# Altium project PCB_Project1.PrjPCB
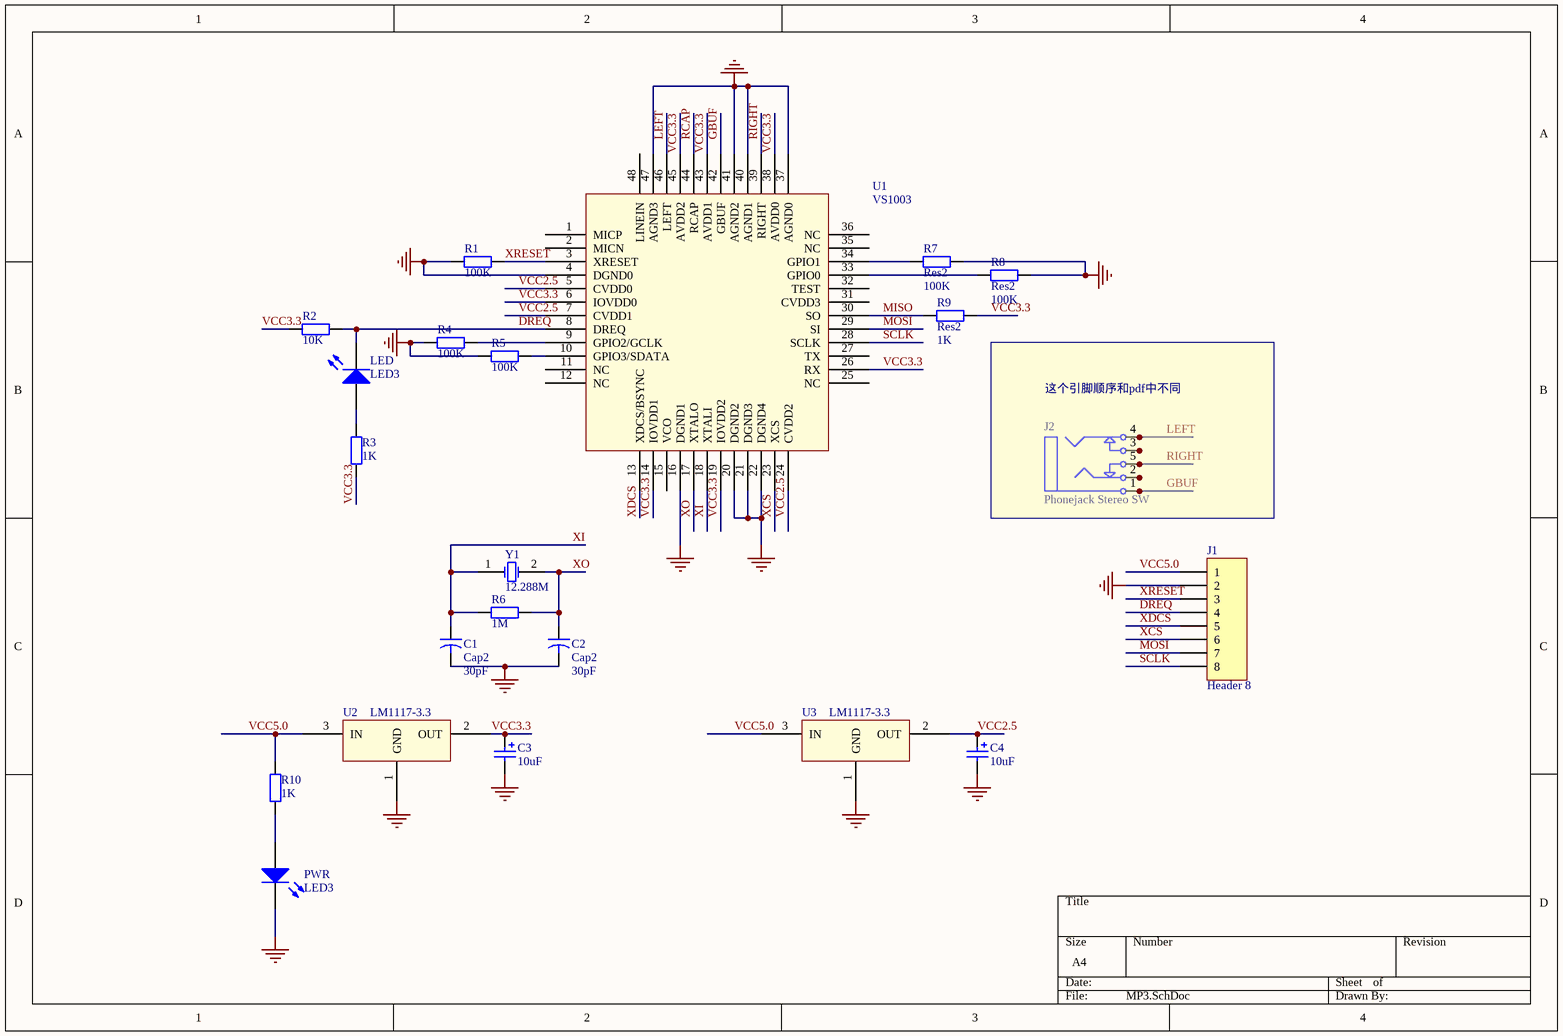
[diagram p0: MP3.SchDoc]
2 sheets, 38 parts. Net scope: global (net labels, ports and power ports of the same name join across sheets).
Sheets:
  MP3.SchDoc
  SD.SchDoc

## Sheet MP3.SchDoc
size A4

### Parts
(Parts that share a designator on the sheet are numbered #1, #2 ... from top to bottom, then left to right.)
C1  Cap2  value 30pF  [CAPR5-4X5]
C2  Cap2  value 30pF  [CAPR5-4X5]
C3#1  value 10uF  [CC2012-0805]  (hidden comment: Cap Pol3)
C4  value 10uF  [CC2012-0805]  (hidden comment: Cap Pol3)
J1  Header 8  [HDR1X8]
J2  Phonejack Stereo SW  [ST-3150-5N]
LED  LED3  [SMD _LED]
PWR#1  LED3  [SMD _LED]
R1#1  value 100K  [AXIAL-0.4]  (hidden comment: Res2)
R2#1  value 10K  [AXIAL-0.4]  (hidden comment: Res2)
R3#1  value 1K  [AXIAL-0.4]  (hidden comment: Res2)
R4#1  value 100K  [AXIAL-0.4]  (hidden comment: Res2)
R5#1  value 100K  [AXIAL-0.4]  (hidden comment: Res2)
R6#1  value 1M  [AXIAL-0.4]  (hidden comment: Res2)
R7  Res2  value 100K  [AXIAL-0.4]
R8  Res2  value 100K  [AXIAL-0.4]
R9  Res2  value 1K  [AXIAL-0.4]
R10#1  value 1K  [AXIAL-0.4]  (hidden comment: Res2)
U1#1  VS1003  [vs1003]
U2  LM1117-3.3  [SOT-223]
U3  LM1117-3.3  [SOT-223]
Y1  12.288M  [BCY-W2/D3.1]

### Blocks framed on the sheet
这个引脚顺序和pdf中不同: J2

### Nets
GND: C1.2 C2.2 C3#1.2 C4.2 J1.2 PWR#1.2(K) R1#1.1 R4#1.1 R5#1.1 R7.2 R8.2 U1#1.4(DGND0) U1#1.16(DGND1) U1#1.20(DGND2) U1#1.21(DGND3) U1#1.22(DGND4) U1#1.37(AGND0) U1#1.40(AGND1) U1#1.41(AGND2) U1#1.47(AGND3) U2.1(GND) U3.1(GND)
VCC3.3: C3#1.1 R2#1.1 R3#1.1 R9.2 U1#1.6(IOVDD0) U1#1.14(IOVDD1) U1#1.19(IOVDD2) U1#1.26(RX) U1#1.38(AVDD0) U1#1.43(AVDD1) U1#1.45(AVDD2) U2.2(OUT)
VCC5.0: J1.1 R10#1.1 U2.3(IN) U3.3(IN)
DREQ: J1.4 LED.2(K) R2#1.2 U1#1.8(DREQ)
GBUF: J2.1 J2.1A J2.1B U1#1.42(GBUF)
LEFT: J2.4 J2.4A J2.4B U1#1.46(LEFT)
MISO: R9.1 U1#1.30(SO)
MOSI: J1.7 U1#1.29(SI)
RCAP: U1#1.44(RCAP)
RIGHT: J2.5 J2.5A J2.5B U1#1.39(RIGHT)
SCLK: J1.8 U1#1.28(SCLK)
VCC2.5: C4.1 U1#1.5(CVDD0) U1#1.7(CVDD1) U1#1.24(CVDD2) U3.2(OUT)
XCS: J1.6 U1#1.23(XCS)
XDCS: J1.5 U1#1.13(XDCS/BSYNC)
XI: C1.1 R6#1.1 U1#1.18(XTALI) Y1.1(OSC1)
XO: C2.1 R6#1.2 U1#1.17(XTALO) Y1.2(OSC2)
XRESET: J1.3 R1#1.2 U1#1.3(XRESET)
NetJ2_2: J2.2 J2.2A J2.2B
NetJ2_3: J2.3 J2.3A J2.3B
NetLED_1: LED.1(A) R3#1.2
NetPWR#1_1: PWR#1.1(A) R10#1.2
NetR4#1_2: R4#1.2 U1#1.9(GPIO2/GCLK)
NetR5#1_2: R5#1.2 U1#1.10(GPIO3/SDATA)
NetR7_1: R7.1 U1#1.34(GPIO1)
NetR8_1: R8.1 U1#1.33(GPIO0)

Not connected (* = marked no-connect by the designer): U1#1 1(MICP) 2(MICN) 11(NC) 12(NC) 15(VCO) 25(NC) 27(TX) 31(CVDD3) 32(TEST) 35(NC) 36(NC) 48(LINEIN)

### Library data of the parts
C1 C2 = Cap2: Capacitor; Published: 23-Sep-2002; Publisher: Altium Limited
C3#1 C4 = Cap Pol3: Polarized Capacitor (Surface Mount); Published: 8-Jun-2000; Revision: July-2002: Re-released for DXP Platform.; Publisher: Altium Limited
J1 = Header 8: Header, 8-Pin; Revision: 17-Jul-2002: Re-released for DXP Platform.; Publisher: Altium Limited
J2 = Phonejack Stereo SW: 3-Conductor Jack with 2 break contacts (normals) and 2 auxiliary make contacts; Revision 1: 17-Jul-2002: Re-released for DXP Platform.; Revision 2: 17-Dec-2003: PCB Footprint replaced.; Published: 5-Jan-2004; Datasheet: Latest Revision: 07-Mar-2000; Publisher: Altium Limited
LED PWR#1 = LED3: Typical BLUE SiC LED; Revision 1: Jul-2002: Re-released for DXP Platform.; Revision 2: 17-Dec-2003: PCB Footprint replaced.; Published: 8-Jun-2000; Publisher: Altium Limited
R1#1 R2#1 R3#1 R4#1 R5#1 R6#1 R7-R9 R10#1 = Res2: Resistor; Published: 8-Jun-2000; Revision: July-2002: Re-released for DXP Platform.; Publisher: Altium Limited
Y1 = XTAL: Crystal Oscillator; Published: 8-Jun-2000; Revision: July-2002: Re-released for DXP Platform.; Publisher: Altium Limited

## Sheet SD.SchDoc
size A4
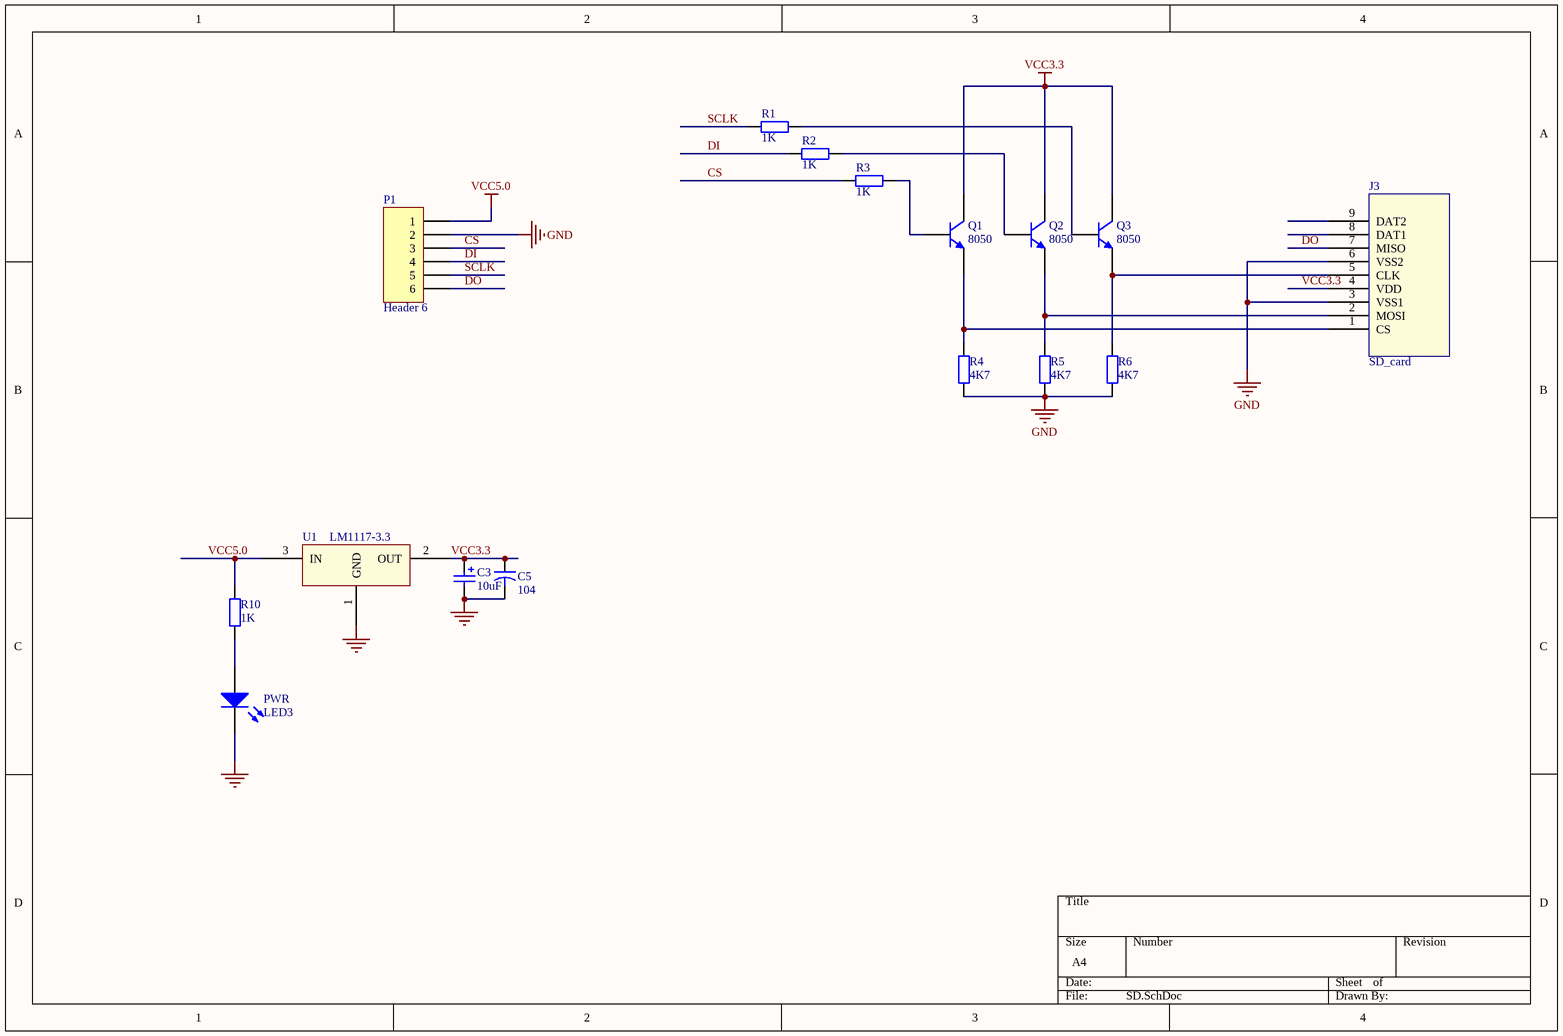
[diagram p1: SD.SchDoc]

### Parts
(Parts that share a designator on the sheet are numbered #1, #2 ... from top to bottom, then left to right.)
C3#2  value 10uF  [CC2012-0805]  (hidden comment: Cap Pol3)
C5  value 104  [CAPR5-4X5]  (hidden comment: Cap2)
J3  SD_card  [SDCARD]
P1  Header 6  [HDR1X6]
PWR#2  LED3  [SMD _LED]
Q1  8050  [TO-92A]
Q2  8050  [TO-92A]
Q3  8050  [TO-92A]
R1#2  value 1K  [AXIAL-0.4]  (hidden comment: Res2)
R2#2  value 1K  [AXIAL-0.4]  (hidden comment: Res2)
R3#2  value 1K  [AXIAL-0.4]  (hidden comment: Res2)
R4#2  value 4K7  [AXIAL-0.4]  (hidden comment: Res2)
R5#2  value 4K7  [AXIAL-0.4]  (hidden comment: Res2)
R6#2  value 4K7  [AXIAL-0.4]  (hidden comment: Res2)
R10#2  value 1K  [AXIAL-0.4]  (hidden comment: Res2)
U1#2  LM1117-3.3  [SOT-223]

### Nets
GND: C3#2.2 C5.2 J3.3(VSS1) J3.6(VSS2) P1.2 PWR#2.2(K) R4#2.1 R5#2.1 R6#2.1 U1#2.1(GND)
VCC3.3: C3#2.1 C5.1 J3.4(VDD) Q1.3(C) Q2.3(C) Q3.3(C) U1#2.2(OUT)
VCC5.0: P1.1 R10#2.1 U1#2.3(IN)
CS: P1.3 R3#2.1
DI: P1.4 R2#2.1
DO: J3.7(MISO) P1.6
SCLK: P1.5 R1#2.1
NetJ3_1: J3.1(CS) Q1.1(E) R4#2.2
NetJ3_2: J3.2(MOSI) Q2.1(E) R5#2.2
NetJ3_5: J3.5(CLK) Q3.1(E) R6#2.2
NetPWR#2_1: PWR#2.1(A) R10#2.2
NetQ1_2: Q1.2(B) R3#2.2
NetQ2_2: Q2.2(B) R2#2.2
NetQ3_2: Q3.2(B) R1#2.2

Not connected (* = marked no-connect by the designer): J3 8(DAT1) 9(DAT2)

### Library data of the parts
C3#2 = Cap Pol3: Polarized Capacitor (Surface Mount); Published: 8-Jun-2000; Revision: July-2002: Re-released for DXP Platform.; Publisher: Altium Limited
C5 = Cap2: Capacitor; Published: 23-Sep-2002; PackageReference: CAPR5-4X5; Publisher: Altium Limited
P1 = Header 6: Header, 6-Pin; LatestRevisionDate: 17-Jul-2002; LatestRevisionNote: Re-released for DXP Platform.; Publisher: Altium Limited
PWR#2 = LED3: as LED on sheet MP3; Published: 8-Jun-2000; Publisher: Altium Limited
Q1-Q3 = 2N3904: NPN General Purpose Amplifier; Published: 8-Jun-2000; LatestRevisionDate: 15-Jan-2003; LatestRevisionNote: PCB Footprint 'BCY-W3/D4.7' replaced; DatasheetDocument: 1997; PackageDocument: Sep-1998; PackageReference: TO-92A; Publisher: Altium Limited; Code_JEDEC: TO-92A; ComponentLink1Description: Manufacturer Link; ComponentLink1URL: http://www.fairchildsemi.com/; ComponentLink2Description: Datasheet; ComponentLink2URL: http://www.fairchildsemi.com/ds/2N%2F2N3904.pdf
R1#2 R2#2 R3#2 R4#2 R5#2 R6#2 R10#2 = Res2: Resistor; Published: 8-Jun-2000; Publisher: Altium Limited
  R1#2 R2#2 R3#2 R4#2 R5#2 R6#2: LatestRevisionDate: 17-Jul-2002; LatestRevisionNote: Re-released for DXP Platform.; PackageReference: AXIAL-0.4
  R10#2: Revision: July-2002: Re-released for DXP Platform.

## Nets that join several sheets
GND: MP3 (22 pins), SD (10 pins)
VCC3.3: MP3 (12 pins), SD (7 pins)
VCC5.0: MP3 (J1.1 R10#1.1 U2.3 U3.3), SD (P1.1 R10#2.1 U1#2.3)
SCLK: MP3 (J1.8 U1#1.28), SD (P1.5 R1#2.1)